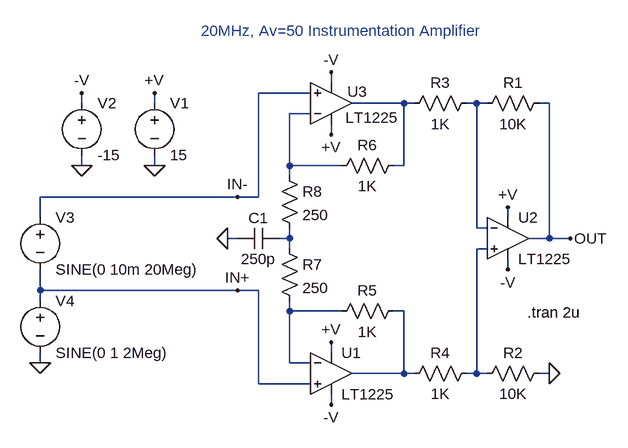
[diagram p0: schematic 1225.asc]
1225.asc, the LTspice schematic file:
Version 4
SHEET 1 896 728
WIRE 48 64 48 48
WIRE 16 80 -64 80
WIRE -336 96 -336 80
WIRE -224 96 -224 80
WIRE 160 96 80 96
WIRE 176 96 160 96
WIRE 272 96 256 96
WIRE 288 96 272 96
WIRE 384 96 368 96
WIRE 16 112 -16 112
WIRE 48 144 48 128
WIRE -336 192 -336 176
WIRE -224 192 -224 176
WIRE -16 192 -16 112
WIRE 64 192 -16 192
WIRE 160 192 160 96
WIRE 160 192 144 192
WIRE -16 208 -16 192
WIRE -96 240 -400 240
WIRE -64 240 -64 80
WIRE -64 240 -96 240
WIRE -400 272 -400 240
WIRE 320 272 320 256
WIRE 272 288 272 96
WIRE 288 288 272 288
WIRE -96 304 -112 304
WIRE -16 304 -16 288
WIRE -16 304 -32 304
WIRE 384 304 384 96
WIRE 384 304 352 304
WIRE 416 304 384 304
WIRE -16 320 -16 304
WIRE 288 320 272 320
WIRE 320 352 320 336
WIRE -400 384 -400 352
WIRE -96 384 -400 384
WIRE -64 384 -96 384
WIRE -400 400 -400 384
WIRE -16 416 -16 400
WIRE 64 416 -16 416
WIRE 160 416 144 416
WIRE 48 480 48 464
WIRE -400 496 -400 480
WIRE -16 496 -16 416
WIRE 16 496 -16 496
WIRE 160 512 160 416
WIRE 160 512 80 512
WIRE 176 512 160 512
WIRE 272 512 272 320
WIRE 272 512 256 512
WIRE 288 512 272 512
WIRE 384 512 368 512
WIRE -64 528 -64 384
WIRE 16 528 -64 528
WIRE 48 560 48 544
FLAG -224 192 0
FLAG 320 256 +V
FLAG -224 80 +V
FLAG 320 352 -V
FLAG -336 192 0
FLAG -336 80 -V
FLAG 48 464 +V
FLAG 48 560 -V
FLAG 48 144 +V
FLAG 48 48 -V
FLAG 384 512 0
FLAG -112 304 0
FLAG -400 496 0
FLAG 416 304 OUT
FLAG -96 240 IN-
FLAG -96 384 IN+
SYMBOL voltage -224 80 R0
SYMATTR InstName V1
SYMATTR Value 15
SYMBOL voltage -336 80 R0
SYMATTR InstName V2
SYMATTR Value -15
SYMBOL res 384 80 R90
WINDOW 0 0 56 VBottom 0
WINDOW 3 32 56 VTop 0
SYMATTR InstName R1
SYMATTR Value 10K
SYMBOL res 384 496 R90
WINDOW 0 0 56 VBottom 0
WINDOW 3 32 56 VTop 0
SYMATTR InstName R2
SYMATTR Value 10K
SYMBOL res 272 80 R90
WINDOW 0 0 56 VBottom 0
WINDOW 3 32 56 VTop 0
SYMATTR InstName R3
SYMATTR Value 1K
SYMBOL res 272 496 R90
WINDOW 0 0 56 VBottom 0
WINDOW 3 32 56 VTop 0
SYMATTR InstName R4
SYMATTR Value 1K
SYMBOL res 160 400 R90
WINDOW 0 0 56 VBottom 0
WINDOW 3 32 56 VTop 0
SYMATTR InstName R5
SYMATTR Value 1K
SYMBOL res 160 176 R90
WINDOW 0 0 56 VBottom 0
WINDOW 3 32 56 VTop 0
SYMATTR InstName R6
SYMATTR Value 1K
SYMBOL res -32 304 R0
SYMATTR InstName R7
SYMATTR Value 250
SYMBOL res -32 192 R0
SYMATTR InstName R8
SYMATTR Value 250
SYMBOL cap -32 288 R90
WINDOW 0 0 32 VBottom 0
WINDOW 3 32 32 VTop 0
SYMATTR InstName C1
SYMATTR Value 250p
SYMBOL voltage -400 384 R0
SYMATTR InstName V4
SYMATTR Value SINE(0 1 2Meg)
SYMBOL voltage -400 256 R0
SYMATTR InstName V3
SYMATTR Value SINE(0 10m 20Meg)
SYMBOL opamps\\LT1225 48 448 R0
SYMATTR InstName U1
SYMBOL opamps\\LT1225 320 240 R0
SYMATTR InstName U2
SYMBOL opamps\\LT1225 48 160 M180
WINDOW 0 25 82 Left 0
WINDOW 3 22 42 Left 0
SYMATTR InstName U3
TEXT 350 418 Left 0 !.tran 2u
TEXT 64 0 Bottom 0 ;20MHz, Av=50 Instrumentation Amplifier

The netlist it stands for:
* 1225.asc
V1 +V 0 15
V2 -V 0 -15
R1 OUT N002 10K
R2 0 N005 10K
R3 N002 N001 1K
R4 N005 N007 1K
R5 N007 N006 1K
R6 N001 N003 1K
R7 N004 N006 250
R8 N003 N004 250
C1 N004 0 250p
V4 IN+ 0 SINE(0 1 2Meg)
V3 IN- IN+ SINE(0 10m 20Meg)
XU1 IN+ N006 +V -V N007 LT1225  ; pins In+ In- V+ V- OUT
XU2 N005 N002 +V -V OUT LT1225  ; pins In+ In- V+ V- OUT
XU3 IN- N003 +V -V N001 LT1225  ; pins In+ In- V+ V- OUT
.tran 2u
* 20MHz, Av=50 Instrumentation Amplifier
.backanno
.end